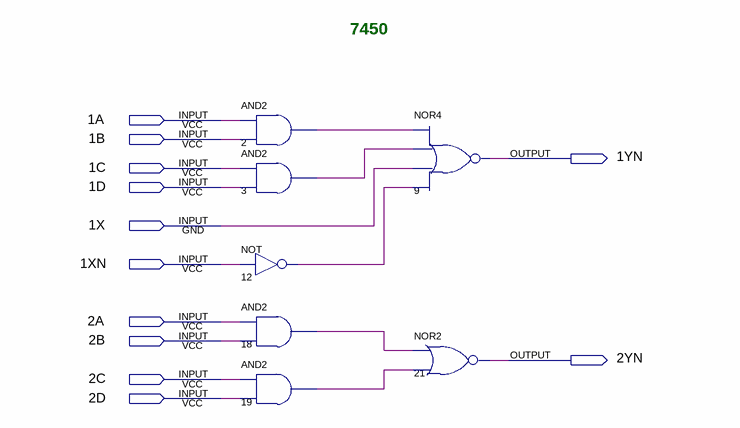
[diagram p0: schematic sheet]
// Quartus schematic 7450.bdf as structural Verilog: 7 symbols, 12 pins
module \7450  (
  input  \1A ,
  input  \1B ,
  input  \1C ,
  input  \1D ,
  input  \1X ,
  input  \1XN ,
  input  \2A ,
  input  \2B ,
  input  \2C ,
  input  \2D ,
  output \1YN ,
  output \2YN 
);

  wire n2_out, n3_out, n12_out, n18_out, n19_out;

  and u_2 (n2_out, \1A , \1B );
  and u_3 (n3_out, \1C , \1D );
  not u_12 (n12_out, \1XN );
  and u_18 (n18_out, \2A , \2B );
  and u_19 (n19_out, \2C , \2D );
  nor u_9 (\1YN , n2_out, n3_out, \1X , n12_out);
  nor u_21 (\2YN , n18_out, n19_out);

  // Notes on the sheet:
  //   7450
endmodule
